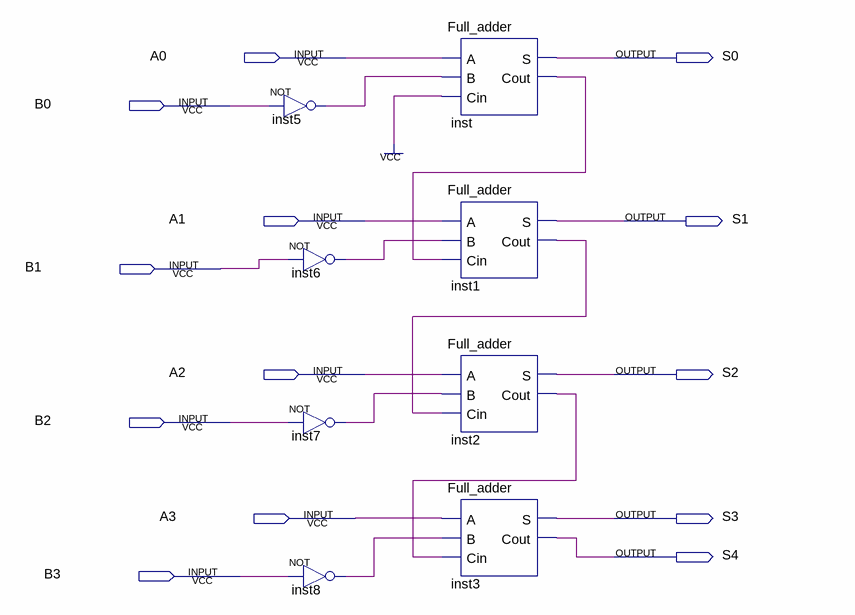
[diagram p0: schematic sheet]
// Quartus schematic Subtracter.bdf as structural Verilog: 8 symbols, 13 pins
module Subtracter (
  input  A0,
  input  B0,
  input  A1,
  input  B1,
  input  A2,
  input  B2,
  input  A3,
  input  B3,
  output S0,
  output S1,
  output S2,
  output S3,
  output S4
);

  wire inst1_cout, inst2_cout, inst5_out, inst6_out, inst7_out, inst8_out, inst_cout;

  not inst5 (inst5_out, B0);
  not inst6 (inst6_out, B1);
  not inst7 (inst7_out, B2);
  not inst8 (inst8_out, B3);
  Full_adder inst (.A(A0), .B(inst5_out), .Cin(1'b1), .S(S0), .Cout(inst_cout));
  Full_adder inst1 (.A(A1), .B(inst6_out), .Cin(inst_cout), .S(S1), .Cout(inst1_cout));
  Full_adder inst2 (.A(A2), .B(inst7_out), .Cin(inst1_cout), .S(S2), .Cout(inst2_cout));
  Full_adder inst3 (.A(A3), .B(inst8_out), .Cin(inst2_cout), .S(S3), .Cout(S4));
endmodule
